# Altium schematic sheet TB-S5D5_p01_TitlePage-v1.2.SchDoc: Renesas DK-S3A7M
size Legal; Author: Jorge Amodio; Organization: Serious Integrated, Inc.; Address1: 145 s 79th Street; Address2: Suite 34; Address3: Chandler, AZ 85226; Address4: USA; DocumentNumber: 1; Revision: v2.0 PCB03; SheetNumber: 1; SheetTotal: 5; CompanyURL: www.seriousintegrated.com; ReleaseDate: 8/4/2015; Company Name: Renesas Electronics America; PageSetup: Record=PageOptions|CenterHorizontal=True|CenterVertical=True|PrintScale=1.00|XCorrection=1.00|YCorrection=1.00|PrintKind=1|BorderSize=5000000|LeftOffset=0|BottomOffset=0|Orientation=2|PaperLength=1000|PaperWidth=1000|Scale=100|PaperSource=7|PrintQuality=-4|MediaType=1|DitherType=10|PaperKind=A5 148x210mm|PrintScaleMode=1
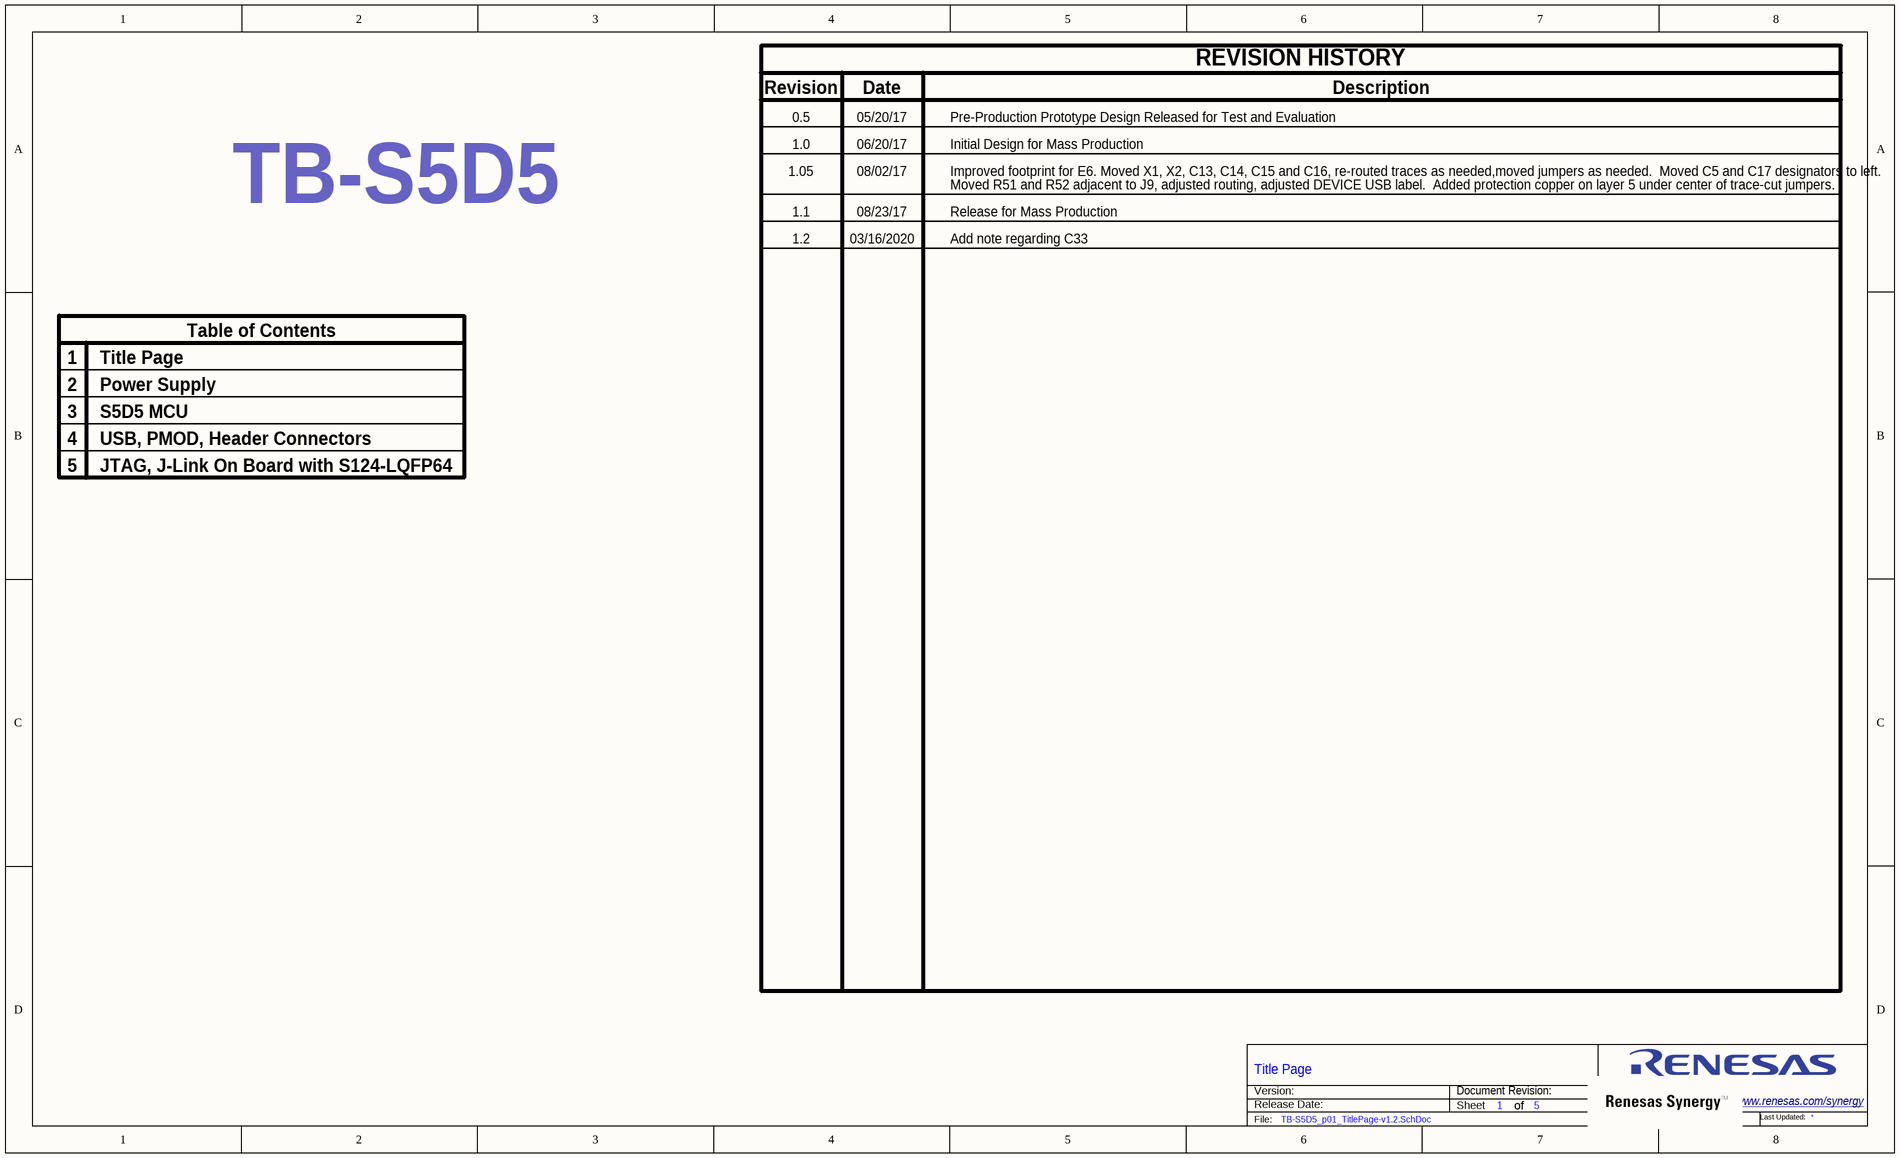
[diagram p0: TB-S5D5_p01_TitlePage-v1.2.SchDoc]

## Notes on the sheet
- Revision
- Date
- REVISION HISTORY
- Description
- 0.5
- 1.0
- 05/20/17
- 06/20/17
- Pre-Production Prototype Design Released for Test and Evaluation
- Initial Design for Mass Production
- TB-S5D5
- 1.05
- 1.1
- 08/02/17
- 08/23/17
- Improved footprint for E6. Moved X1, X2, C13, C14, C15 and C16, re-routed traces as needed,moved jumpers as needed.  Moved C5 and C17 designators to left.
- Moved R51 and R52 adjacent to J9, adjusted routing, adjusted DEVICE USB label.  Added protection copper on layer 5 under center of trace-cut jumpers.
- Release for Mass Production
- 1.2
- 03/16/2020
- Add note regarding C33
- 1
- Title Page
- Table of Contents
- 2
- 3
- Power Supply
- S5D5 MCU
- 4
- 5
- USB, PMOD, Header Connectors
- JTAG, J-Link On Board with S124-LQFP64
- Version:
- Release Date:
- Document Revision:
- Sheet
- of
- www.renesas.com/synergy <http://www.renesas.com/synergy>
- File:
- 60
- Last Updated: